# Altium schematic sheet SME_mp2759gq.SchDoc: Titulo
size OrCAD A; Author: Ismael Poblete V.; CompanyName: SME; Organization: SME; Address1: Santiago, Chile; DocumentNumber: SME-UNO; Revision: 1.0; SheetNumber: 4; SheetTotal: 7
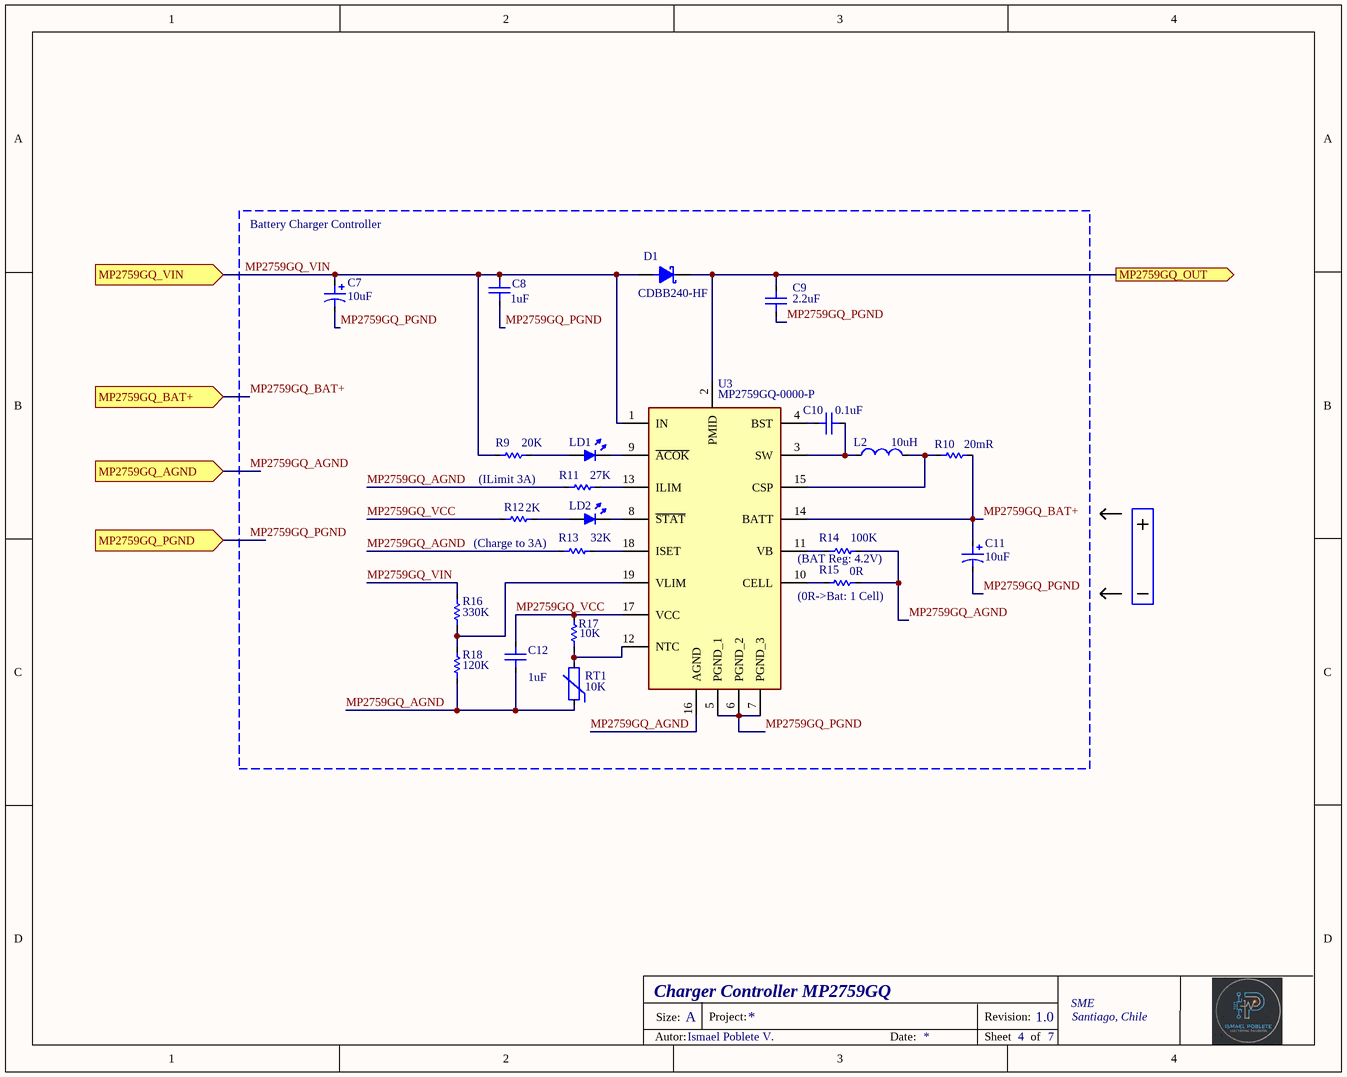
[diagram p0: SME_mp2759gq.SchDoc]

## Parts
C7  Capacitance: 10uF  [CASE_A]  (hidden comment: T491A106M016AT)
C8  Capacitance: 1uF  [C0603]  (hidden comment: CC0603KRX5R6BB105)
C9  Capacitance: 2.2uF  [C0603]  (hidden comment: CC0603KRX7R5BB225)
C10  Capacitance: 0.1uF  [C0603]  (hidden comment: CC0603KRX7R9BB104)
C11  Capacitance: 10uF  [CASE_A]  (hidden comment: T491A106M016AT)
C12  Capacitance: 1uF  [C0603]  (hidden comment: CC0603KRX5R6BB105)
D1  CDBB240-HF  [DO-214AA-2]
L2  10uH  [5050 _H4mm]
LD1  HSMS-C170  [LED_0805_WHITE]  (value not drawn)
LD2  HSMS-C170  [LED_0805_WHITE]  (value not drawn)
R9  Resistance: 20K  [RES_0603]  (hidden comment: RT0603FRE0720KL)
R10  Resistance: 20mR  [RES_1206]  (hidden comment: PE1206FRE470R02L)
R11  Resistance: 27K  [RES_0603]  (hidden comment: RT0603FRE0727KL)
R12  Resistance: 2K  [RES_0603]  (hidden comment: RT0603FRE072KL)
R13  Resistance: 32K  [RES_0603]  (hidden comment: RT0603BRD0732KL)
R14  Resistance: 100K  [RES_0603]  (hidden comment: RT0603FRD07100KL)
R15  Resistance: 0R  [RES_0805]  (hidden comment: RC0805FR-100RL)
R16  Resistance: 330K  [RES_0603]  (hidden comment: RT0603DRD07330KL)
R17  Resistance: 10K  [RES_0603]  (hidden comment: RT0603FRE0710KL)
R18  Resistance: 120K  [RES_0603]  (hidden comment: RT0603BRD07120KL)
RT1  Resistance: 10K  [103AT2]  (hidden comment: 103AT-2)
U3  MP2759GQ-0000-P  [QFN19_MP2759GQ0000P]

## Ports
MP2759GQ_AGND (in, see SME_Main[2B]), MP2759GQ_BAT+ (in, see SME_Main[1B]), MP2759GQ_OUT (out, see SME_Main[2B]), MP2759GQ_PGND (in, see SME_Main[2B]), MP2759GQ_VIN (in, see SME_Main[1B])

## Nets
MP2759GQ_AGND: C12.1 R11.1 R13.1 R14.2 R15.1 R18.1 RT1.1 U3.16(AGND) ; port MP2759GQ_AGND
MP2759GQ_BAT+: C11.1 R10.2 U3.14(BATT) ; port MP2759GQ_BAT+
MP2759GQ_OUT: C9.2 D1.2(K) U3.2(PMID) ; port MP2759GQ_OUT
MP2759GQ_PGND: C7.2 C8.1 C9.1 C11.2 U3.5(PGND_1) U3.6(PGND_2) U3.7(PGND_3) ; port MP2759GQ_PGND
MP2759GQ_VCC: C12.2 R12.1 R17.2 U3.17(VCC)
MP2759GQ_VIN: C7.1 C8.2 D1.1(A) R9.1 R16.2 U3.1(IN) ; port MP2759GQ_VIN
NetC10_1: C10.1 L2.1 U3.3(SW)
NetC10_2: C10.2 U3.4(BST)
NetL2_2: L2.2 R10.1 U3.15(CSP)
NetLD1_1: LD1.1(A) R9.2
NetLD1_2: LD1.2(K) U3.9(~{ACOK})
NetLD2_1: LD2.1(A) R12.2
NetLD2_2: LD2.2(K) U3.8(~{STAT})
NetR11_2: R11.2 U3.13(ILIM)
NetR13_2: R13.2 U3.18(ISET)
NetR14_1: R14.1 U3.11(VB)
NetR15_2: R15.2 U3.10(CELL)
NetR16_1: R16.1 R18.2 U3.19(VLIM)
NetR17_1: R17.1 RT1.2 U3.12(NTC)

## Notes on the sheet
- (near C7) Battery Charger Controller
- (ILimit 3A)
- (near R13) (Charge to 3A)
- (near R15) (0R->Bat: 1 Cell)
- (near R14) (BAT Reg: 4.2V)
- Charger Controller MP2759GQ
- Size:
- A
- Project:
- Revision:
- Autor:
- Date:
- Sheet
- of

## Library data of the parts
C7 C11 = T491A106M016AT: KEMET - T491A106M016AT - Surface Mount Tantalum Capacitor, 10 µF, 16 V, 1206 [3216 Metric], T491 Series, ± 20%, -55 °C; Manufacturer: Yageo Group; Material: Ceramic; Tolerance: 10%; Dielectric: X5R; Voltage Rating (DC): 10V; ESR (Equivalent Series Resistance): 7R; Life (Hours): 2000Hour; Dissipation Factor: 8%; Leakage Current: 1.6uA; Polarity: Polar; Ripple Current: 104mA; Voltage: 16V; Type: SMD; Supplier 1: Digi-Key; Supplier Part Number 1: 1276-1192-1-ND; Manufacturer Part Number: T491A106M016AT; RoHS: Yes; Category: Ceramic Capacitors; Stock 1: 1573745; Pricing 1: 1=0.19000, 10=0.13200, 50=0.07940, 100=0.06700, 500=0.04588, 1000=0.04058 (USD); Mount: Surface Mount; Case/Package: 0603; Case Code (Metric): 1608; Case Code (Imperial): 0603; Contact Plating: Tin; Min Operating Temperature: -55°C; Max Operating Temperature: 85°C; Package Quantity: 1; Packaging: Tape and Reel; Voltage Rating: 10V; Length: 1.6mm; Height: 0.8mm; Thickness: 0.035inch; Depth: 0.8mm; Width: 0.031inch; Radiation Hardening: No; Lead Free: Lead Free; ComponentLink1URL: https://datasheet.ciiva.com/26877/getdatasheetpartid-359551-26877881.pdf?src-supplier=Verical; ComponentLink1Description: https://datasheet.ciiva.com/26877/getdatasheetpartid-359551-26877881.pdf?src-supplier=Verical; ComponentLink2URL: https://datasheet.ciiva.com/29198/457369-da-01-en-vs-kondensator-0603-29198790.pdf?src-supplier=Conrad; ComponentLink2Description: https://datasheet.ciiva.com/29198/457369-da-01-en-vs-kondensator-0603-29198790.pdf?src-supplier=Conrad; ComponentLink3URL: https://datasheet.ciiva.com/16200/cl05b104kq5nnnc-16200766.pdf?src-supplier=Future+Electronics; ComponentLink3Description: https://datasheet.ciiva.com/16200/cl05b104kq5nnnc-16200766.pdf?src-supplier=Future+Electronics; Supplier 2: Digi-Key; Supplier Part Number 2: 399-3687-1-ND; Stock 2: 249031; Pricing 2: 1=0.43000, 10=0.29900, 50=0.20940, 100=0.17950, 500=0.13464, 1000=0.11370 (USD); Dielectric Material: Tantalum; Features: General Purpose; Termination: SMD/SMT; Height - Seated (Max): 0.071inch; Lead Pitch: 1.2mm; REACH SVHC: No SVHC; ComponentLink4URL: https://datasheet.ciiva.com/27092/1573281-27092884.pdf?src-supplier=Jameco; ComponentLink4Description: https://datasheet.ciiva.com/27092/1573281-27092884.pdf?src-supplier=Jameco; ComponentLink5URL: https://datasheet.ciiva.com/7696/1732759-7696297.pdf?src-supplier=Element14; ComponentLink5Description: https://datasheet.ciiva.com/7696/1732759-7696297.pdf?src-supplier=Element14; ComponentLink6URL: https://datasheet.ciiva.com/7696/1854511-7696298.pdf?src-supplier=Element14; ComponentLink6Description: https://datasheet.ciiva.com/7696/1854511-7696298.pdf?src-supplier=Element14; ComponentLink7URL: https://datasheet.ciiva.com/257/kem-t2005-t491-257611.pdf?src-supplier=Digi-Key; ComponentLink7Description: https://datasheet.ciiva.com/257/kem-t2005-t491-257611.pdf?src-supplier=Digi-Key; ComponentLink8URL: https://datasheet.ciiva.com/5934/kem-t2005-t491-5934795.pdf?src-supplier=Farnell; ComponentLink8Description: https://datasheet.ciiva.com/5934/kem-t2005-t491-5934795.pdf?src-supplier=Farnell; ComponentLink9URL: https://datasheet.ciiva.com/257/kem-t2005-t491-257612.pdf?src-supplier=Digi-Key; ComponentLink9Description: https://datasheet.ciiva.com/257/kem-t2005-t491-257612.pdf?src-supplier=Digi-Key; ComponentLink10URL: https://datasheet.ciiva.com/257/kem-t2005-t491-257613.pdf?src-supplier=Digi-Key; ComponentLink10Description: https://datasheet.ciiva.com/257/kem-t2005-t491-257613.pdf?src-supplier=Digi-Key; ComponentLink11URL: https://datasheet.ciiva.com/12883/kem-t2005-t491-12883118.pdf?src-supplier=Mouser; ComponentLink11Description: https://datasheet.ciiva.com/12883/kem-t2005-t491-12883118.pdf?src-supplier=Mouser; ComponentLink12URL: https://datasheet.ciiva.com/14589/70095774-14589054.pdf?src-supplier=Allied+Electronics; ComponentLink12Description: https://datasheet.ciiva.com/14589/70095774-14589054.pdf?src-supplier=Allied+Electronics; ComponentLink13URL: https://datasheet.ciiva.com/14597/70095774-14597406.pdf?src-supplier=Allied+Electronics; ComponentLink13Description: https://datasheet.ciiva.com/14597/70095774-14597406.pdf?src-supplier=Allied+Electronics; Package: A Case
C8 C12 = CC0603KRX5R6BB105: Multilayer Ceramic Capacitors MLCC - SMD/SMT 10V 1uF X5R 0603 10% HI CV; Manufacturer: Yageo Group; Type: SMD; Package: 0603; Manufacturer Part Number: CC0603KRX5R6BB105
C9 = CC0603KRX7R5BB225: Multilayer Ceramic Capacitors MLCC - SMD/SMT 6.3V 2.2uF X7R 0603 10% HI CV
C10 = CC0603KRX7R9BB104: Multilayer Ceramic Capacitors MLCC - SMD/SMT 50 V 0.1uF X7R 0603 10%; Manufacturer: Yageo Group; Type: SMD; Package: 0603; Manufacturer Part Number: CC0603KRX7R9BB104
D1 = CDBB240-HF: Schottky Diode; Manufacturer_Name: Comchip Technology; Manufacturer: Comchip; Type: SMD; Datasheet Link: https://datasheet.datasheetarchive.com/originals/distributors/DKDS41/DSANUWW0021461.pdf; Height: 3.2mm; Manufacturer_Part_Number: CDBB240-HF; Mouser Part Number: 750-CDBB240-HF; Mouser Price/Stock: https://www.mouser.co.uk/ProductDetail/Comchip-Technology/CDBB240-HF?qs=%252BiOMRfgENTHvuVH5OF%252BwbA%3D%3D; Arrow Part Number: CDBB240-HF; Arrow Price/Stock: https://www.arrow.com/en/products/cdbb240-hf/comchip-technology?region=nac; Package: DO-214AA-2; Manufacturer Part Number: CDBB240-HF
L2 = SRR1240-100M: Power Inductors - SMD 10uH 20% SMD 1240; Manufacturer_Name: Bourns; Manufacturer: Samsung Electro-Mechanics; Manufacturer Part Number: CIGT201210UHR47MNE; Datasheet Link: https://www.mouser.it/datasheet/2/54/SRR1240-1391459.pdf; Height: 4.5mm; Manufacturer_Part_Number: SRR1240-100M; Mouser Part Number: 652-SRR1240-100M; Mouser Price/Stock: https://www.mouser.co.uk/ProductDetail/Bourns/SRR1240-100M?qs=uD%2FoUDWqfvRyQbveYihOGw%3D%3D; Arrow Part Number: SRR1240-100M; Arrow Price/Stock: https://www.arrow.com/en/products/srr1240-100m/bourns?region=europe; ComponentLink1Description: New link; ComponentLink1URL: https://www.mouser.com/ProductDetail/Bourns/SRR1240-100M?qs=uD%2FoUDWqfvRyQbveYihOGw%3D%3D; Package: 0805; Type: SMD
LD1 LD2 = HSMS-C170: Single Color LEDs Red Diffused 626nm 10mcd; Manufacturer: Broadcom; Type: SMD; Package: HSMS-C170; Manufacturer Part Number: HSMS-C170
R9 = RT0603FRE0720KL: Thin Film Resistors - SMD 1/10W 20K ohm 1% 50ppm; Manufacturer: Yageo Group; Case/Package: 0603; Package: 0603; Type: SMD; Manufacturer Part Number: RT0603FRE0720KL
R10 = PE1206FRE470R02L: Current Sense Resistors - SMD 20 mOhms 1 W 50PPM/C 1206; Manufacturer: Yageo Group; Package: 1206; Type: SMD; Manufacturer Part Number: PE1206FRE470R02L
R11 = RT0603FRE0727KL: Thin Film Resistors - SMD 1/10W 27K ohm 1% 50ppm; Manufacturer: Yageo Group; Case/Package: 0603; Package: 0603; Type: SMD; Manufacturer Part Number: RT0603FRE0727KL
R12 = RT0603FRE072KL: Thin Film Resistors - SMD 1/10W 2K ohm 1% 50ppm; Case/Package: 0603
R13 = RT0603BRD0732KL: Thin Film Resistors - SMD 1/10W 32K Ohms 0.1%; Manufacturer: Yageo Group; Case/Package: 0603; Package: 0603; Type: SMD; Manufacturer Part Number: RT0603BRD0732KL
R14 = RT0603FRD07100KL: Thin Film Resistors - SMD 100K OHM 1% 25PPM 1/10W; Manufacturer: Yageo Group; Case/Package: 0603; Package: 0603; Type: SMD; Manufacturer Part Number: RT0603FRD07100KL
R15 = RC0805FR-100RL: Thick Film Resistors - SMD General Purpose Chip Resistor 0805, 0Ohms, 1%, 1/8W; Manufacturer: Yageo Group; Manufacturer Part Number: RC0805FR-10100RL; Case/Package: 0805; Package: 0805; Type: SMD
R16 = RT0603DRD07330KL: Thin Film Resistors - SMD 330K OHM .5% 25PPM 1/10W
R17 = RT0603FRE0710KL: Thin Film Resistors - SMD 10K ohm 1% 1/10W; Manufacturer: Yageo Group; Case/Package: 0603; Package: 0603; Type: SMD; Manufacturer Part Number: RT0603FRE0710KL
R18 = RT0603BRD07120KL: Thin Film Resistors - SMD 1/10W 120K ohm .1% 25ppm
RT1 = 103AT-2: NTC Thermistors 10kohm 1%; Manufacturer: Semitec; Package: 2 Pos; Type: thru-hole; Manufacturer Part Number: 103AT-2
U3 = MP2759GQ-0000-P: Integrated Circuit; Manufacturer_Name: Monolithic Power Systems (MPS); Manufacturer: Monolithic Power Systems; Datasheet Link: https://www.monolithicpower.cn/cn/documentview/productdocument/index/version/2/document_type/Datasheet/lang/en/sku/MP2759GQ/; Height: 1mm; Manufacturer_Part_Number: MP2759GQ-0000-P; Mouser Part Number: 946-MP2759GQ-0000-P; Mouser Price/Stock: https://www.mouser.co.uk/ProductDetail/Monolithic-Power-Systems-MPS/MP2759GQ-0000-P?qs=QNEnbhJQKvaMJpbzSVzajw%3D%3D; Package: QFN-19; Type: SMD; Manufacturer Part Number: MP2759GQ-0000-P